# Altium schematic sheet USBOTGUnit.SchDoc
size A4
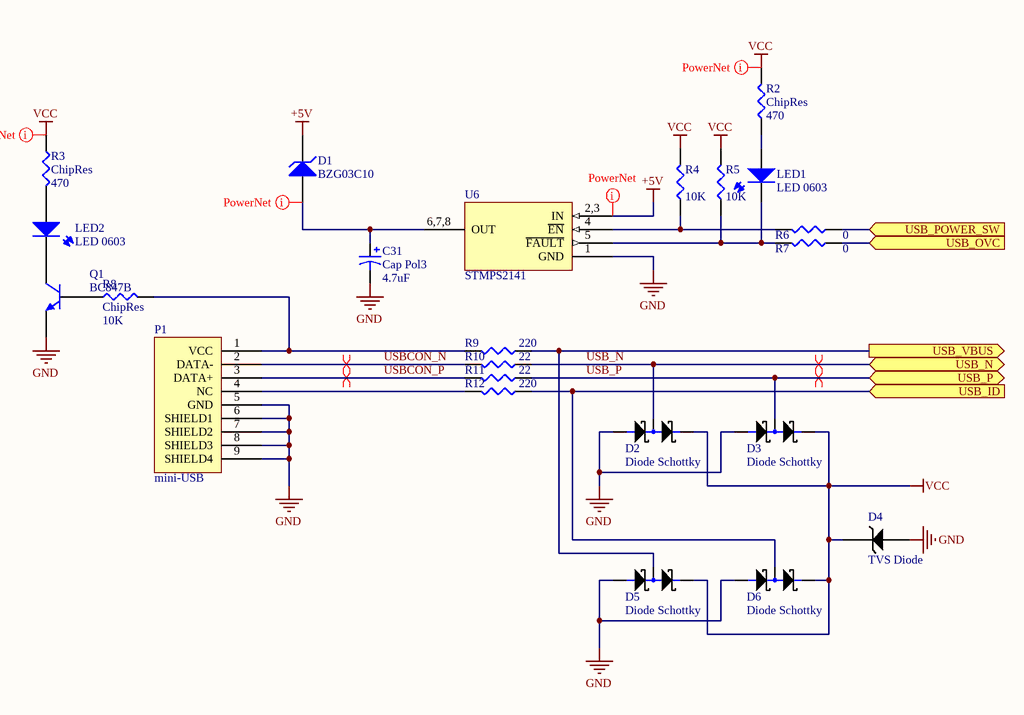
[diagram p0: USBOTGUnit.SchDoc]

## Parts
C31  Cap Pol3  value 4.7uF  [2220]
D1  BZG03C10  [DO214]
D2  Diode Schottky  [SOT23]
D3  Diode Schottky  [SOT23]
D4  TVS Diode  [DO-214AS]
D5  Diode Schottky  [SOT23]
D6  Diode Schottky  [SOT23]
LED1  LED 0603  [LED 0603]
LED2  LED 0603  [LED 0603]
P1  mini-USB  [USB/SM0.8-6H5]
Q1  BC847B  [SOT23]
R2  ChipRes  value 470  [RES0805]
R3  ChipRes  value 470  [RES0805]
R4  value 10K  [RES0805]  (hidden comment: ChipRes)
R5  value 10K  [RES0805]  (hidden comment: ChipRes)
R6  value 0  [RES0805]  (hidden comment: ChipRes)
R7  value 0  [RES0805]  (hidden comment: ChipRes)
R8  ChipRes  value 10K  [RES0805]
R9  value 220  [RES0805]  (hidden comment: ChipRes)
R10  value 22  [RES0805]  (hidden comment: ChipRes)
R11  value 22  [RES0805]  (hidden comment: ChipRes)
R12  value 220  [RES0805]  (hidden comment: ChipRes)
U6  STMPS2141  [SOP8]

## Ports
USB_ID (in), USB_N (bidir), USB_OVC (in), USB_P (bidir), USB_POWER_SW (in), USB_VBUS (out)

## Nets
+5V: D1.2(K) U6.2,3(IN)
GND: C31.2 D2.1 D3.1 D4.2 D5.1 D6.1 P1.5(GND) P1.6(SHIELD1) P1.7(SHIELD2) P1.8(SHIELD3) P1.9(SHIELD4) Q1.2(E) U6.1(GND)
VCC: D2.2 D3.2 D4.1 D5.2 D6.2 R2.2 R3.2 R4.2 R5.2
USB_ID: D6.3 R12.1 ; port USB_ID
USB_N: D2.3 R10.1 ; port USB_N
USB_OVC: R7.1 ; port USB_OVC
USB_P: D3.3 R11.1 ; port USB_P
USB_POWER_SW: R6.1 ; port USB_POWER_SW
USB_VBUS: D5.3 R9.1 ; port USB_VBUS
USBCON_N: P1.2(DATA-) R10.2
USBCON_P: P1.3(DATA+) R11.2
NetC31_1: C31.1 D1.1(A) U6.6,7,8(OUT)
NetLED1_1: LED1.1 R5.1 R7.2 U6.5(~{FAULT})
NetLED1_2: LED1.2 R2.1
NetLED2_1: LED2.1 Q1.1(C)
NetLED2_2: LED2.2 R3.1
NetP1_1: P1.1(VCC) R8.1 R9.2
NetP1_4: P1.4(NC) R12.2
NetQ1_3: Q1.3(B) R8.2
NetR4_1: R4.1 R6.2 U6.4(~{EN})

## Layout directives
differential pair: USB_N, USB_P, USBCON_N, USBCON_P
net class PowerNet: +5V, NetC31_1, VCC

## Library data of the parts
C31 = Cap Pol3: Polarized Capacitor (Surface Mount); Published: 8-Jun-2000; LatestRevisionDate: 29-May-2009; LatestRevisionNote: IPC-7351 Footprint Added.; PackageReference: C0805; Publisher: Altium Limited; PackageDescription: Chip Capacitor
D1 = BZG03C10: Silicon Zener Diode (3W); Published: 8-Jun-2000; LatestRevisionDate: 17-Jul-2002; LatestRevisionNote: Re-released for DXP Platform.; DatasheetDocument: 1-Apr-1999; PackageDocument: Apr-1999; PackageReference: DO214; Publisher: Altium Limited; ComponentLink1Description: Manufacturer Link; ComponentLink1URL: http://www.vishay.com/; ComponentLink2Description: Datasheet; ComponentLink2URL: http://www.vishay.com/docs/85593/85593.pdf
D2 D3 D5 D6 = Schottky Diode: 2-Diode Schottky
D4 = TVS Diode SMA
LED1 LED2 = LED0603
P1 = miniUSB
Q1 = BC847B: SOT23 NPN Silicon Planar General Purpose Transistor; Published: 8-Jun-2000; LatestRevisionDate: 17-Jul-2002; LatestRevisionNote: Re-released for DXP Platform.; DatasheetVersion: Jan-1997; PackageVersion: 1996; PackageReference: SOT23; Publisher: Altium Limited; PackageDescription: SOT-23; 3 Leads; Body 3.1 x 2.5 mm, inc. leads (LxW max), Alternate Lead Configuration; ComponentLink1Description: Manufacturer Link; ComponentLink1URL: http://www.zetex.com/
R2-R12 = ChipRes: Chip resistor
U6 = STMPS2141: Enhanced single channel power switch; Manual: http://www.st.com/web/en/resource/technical/document/datasheet/CD00167470.pdf